# EAGLE design SAMD21E-breakout (EAGLE 9.4.1)
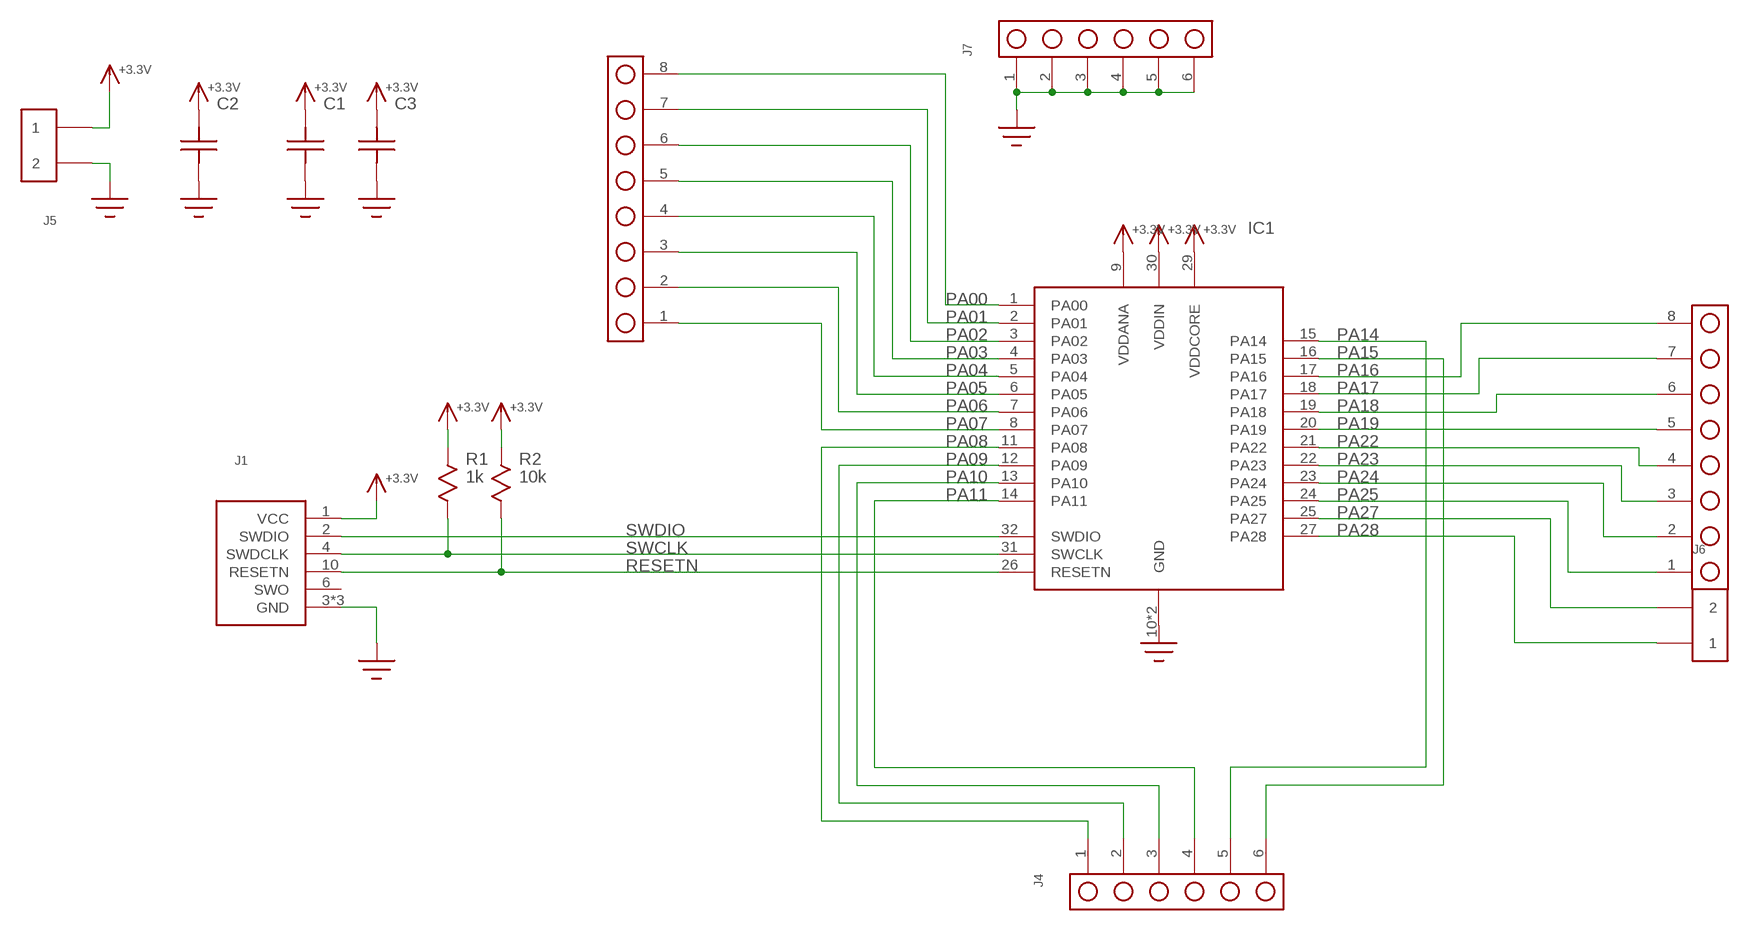
[diagram p0: schematic, sheet 1]

## Parts
C1  C0603  [C0603]
C2  C1206  [1206]
C3  C0603  [C0603]
IC1  SAMD21E  [TQFP32_7X7]
J1  SWD-ICSP-HEADER  [HEADER-2X5-50MIL]
J2  HEADER_8PIN  [HEADER_8_PIN]
J3  HEADER_8PIN  [HEADER_8_PIN]
J4  HEADER_6PIN  [HEADER_6PIN]
J5  HEADER_2PIN  [HEADER_2PIN]
J6  HEADER_2PIN  [HEADER_2PIN]
J7  HEADER_6PIN  [HEADER_6PIN]
R1  1k  R0603  [R0603]
R2  10k  R0603  [R0603]

## Nets
+3.3V: C1.P$2 C2.P$2 C3.P$2 IC1.9(VDDANA) IC1.29(VDDCORE) IC1.30(VDDIN) J1.1(VCC) J5.1 R1.P$1 R2.P$1
GND: C1.P$1 C2.P$1 C3.P$1 IC1.10(GND) IC1.28(GND) J1.3(GND) J1.5(GND) J1.9(GND) J5.2 J7.1 J7.2 J7.3 J7.4 J7.5 J7.6
PA00: IC1.1(PA00) J2.8
PA01: IC1.2(PA01) J2.7
PA02: IC1.3(PA02) J2.6
PA03: IC1.4(PA03) J2.5
PA04: IC1.5(PA04) J2.4
PA05: IC1.6(PA05) J2.3
PA06: IC1.7(PA06) J2.2
PA07: IC1.8(PA07) J2.1
PA08: IC1.11(PA08) J4.1
PA09: IC1.12(PA09) J4.2
PA10: IC1.13(PA10) J4.3
PA11: IC1.14(PA11) J4.4
PA14: IC1.15(PA14) J4.5
PA15: IC1.16(PA15) J4.6
PA16: IC1.17(PA16) J3.8
PA17: IC1.18(PA17) J3.7
PA18: IC1.19(PA18) J3.6
PA19: IC1.20(PA19) J3.5
PA22: IC1.21(PA22) J3.4
PA23: IC1.22(PA23) J3.3
PA24: IC1.23(PA24) J3.2
PA25: IC1.24(PA25) J3.1
PA27: IC1.25(PA27) J6.2
PA28: IC1.27(PA28) J6.1
RESETN: IC1.26(RESETN) J1.10(RESETN) R2.P$2
SWCLK: IC1.31(SWCLK) J1.4(SWDCLK) R1.P$2
SWDIO: IC1.32(SWDIO) J1.2(SWDIO)
Unconnected: J1.6(SWO)

## Library data of the parts
C1-C3 = yapo:C
IC1 = yapo:SAMD21E
J1 = yapo:SWD-ICSP-HEADER
J2 J3 = yapo:HEADER_8PIN
J4 J7 = yapo:HEADER_6PIN
J5 J6 = yapo:HEADER_2PIN
R1 R2 = yapo:R

## Board
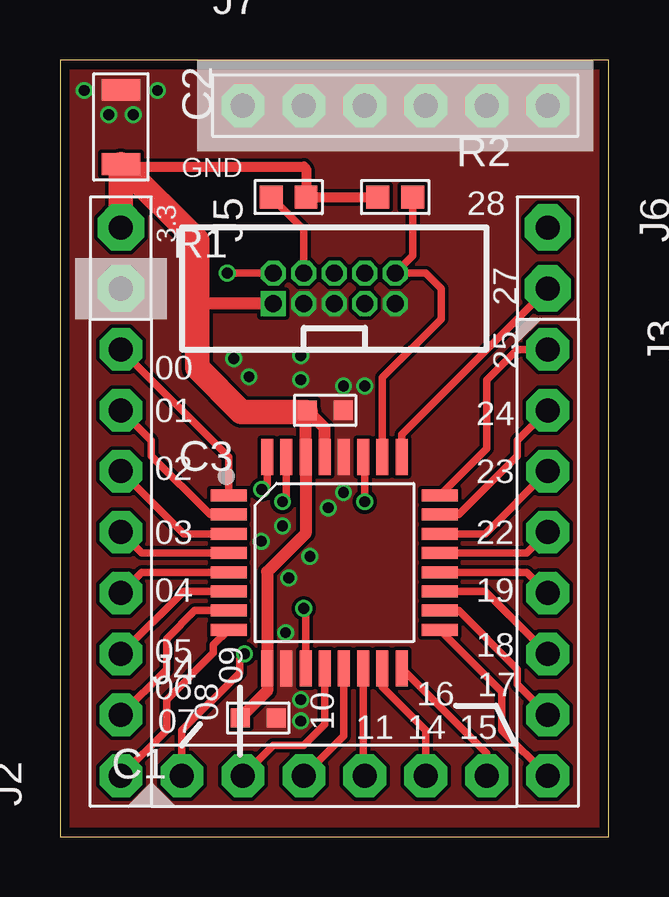
[diagram p1: board, top side]
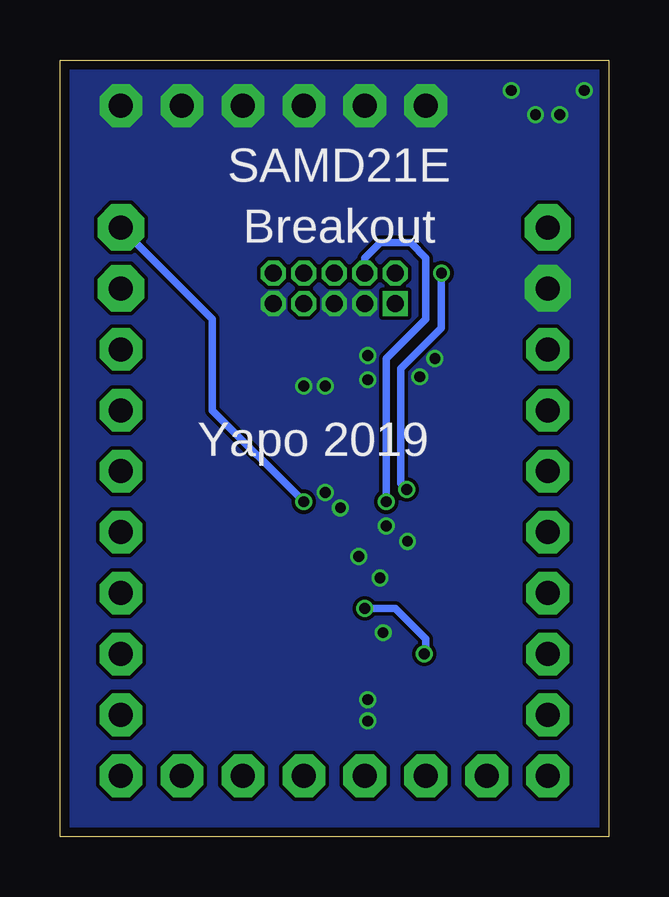
[diagram p2: board, bottom side, seen from below]

Size 22.86 x 32.38 mm. Coordinates in mm from the lower left corner, seen from the top.
Outline: 0,0 22.86,0 22.86,32.38 0,32.38 0,0
Copper layers (1*16): Top 0.035559375mm / dielectric 1.6mm / Bottom 0.035559375mm
Design rules "oshpark-2layer *": minimum track width 6mil, minimum drill 10mil, track to track 6mil, track to pad 6mil, pad to pad 6mil, via to via 6mil, smd to smd 6mil, copper to edge 15mil, drill to drill 6mil, minimum pad ring 5mil, minimum via ring 5mil, stop-mask expansion 2.5mil, vias tented up to drill 20mil, thermal gap 10mil

### Footprints (pad centres in the part's own frame; a part is rotated, then mirrored left to right if it is on the bottom)
C0603 = smd 0.8 x 0.8: P$1 -0.75,0; P$2 0.75,0
1206 = smd 0.9 x 1.6: P$1 -1.55,0; P$2 1.55,0
TQFP32_7X7 = smd 1.5 x 0.5: 1 -4.4,2.8; 2 -4.4,2; 3 -4.4,1.2; 4 -4.4,0.4; 5 -4.4,-0.4; 6 -4.4,-1.2; 7 -4.4,-2; 8 -4.4,-2.8; 17 4.4,-2.8; 18 4.4,-2; 19 4.4,-1.2; 20 4.4,-0.4; 21 4.4,0.4; 22 4.4,1.2; 23 4.4,2; 24 4.4,2.8 | smd 0.5 x 1.5: 9 -2.8,-4.4; 10 -2,-4.4; 11 -1.2,-4.4; 12 -0.4,-4.4; 13 0.4,-4.4; 14 1.2,-4.4; 15 2,-4.4; 16 2.8,-4.4; 25 2.8,4.4; 26 2,4.4; 27 1.2,4.4; 28 0.4,4.4; 29 -0.4,4.4; 30 -1.2,4.4; 31 -2,4.4; 32 -2.8,4.4
HEADER-2X5-50MIL = drill 0.7 pad 1.016 square: 1 -2.54,-0.635 | drill 0.7 pad 1.016 octagon: 2 -2.54,0.635; 3 -1.27,-0.635; 4 -1.27,0.635; 5 0,-0.635; 6 0,0.635; 7 1.27,-0.635; 8 1.27,0.635; 9 2.54,-0.635; 10 2.54,0.635
HEADER_8_PIN = drill 1 pad 1.778 octagon: 1 -8.89,0; 2 -6.35,0; 3 -3.81,0; 4 -1.27,0; 5 1.27,0; 6 3.81,0; 7 6.35,0; 8 8.89,0
HEADER_6PIN = drill 1 pad 1.778 octagon: 1 -6.35,0; 2 -3.81,0; 3 -1.27,0; 4 1.27,0; 5 3.81,0; 6 6.35,0
HEADER_2PIN = drill 1 pad 1.93 octagon: 1 -1.27,0; 2 1.27,0
R0603 = smd 0.95 x 0.95: P$1 -0.725,0; P$2 0.725,0

### Placement (x,y rotation side)
C1  8.26,4.95 180 top
C2  2.54,29.59 270 top
C3  11.05,17.78 180 top
IC1  11.43,11.43 0 top
J1  11.43,22.86 0 top
J2  2.54,11.43 90 top
J3  20.32,11.43 270 top
J4  11.43,2.54 0 top
J5  2.54,24.13 270 top
J6  20.32,24.13 270 top
J7  13.97,30.48 0 top
R1  9.53,26.67 180 top
R2  13.97,26.67 0 top

### Tracks (layer width: path | path; a pad name or v marks a point on that pad's centre or on a via)
+3.3V
  Top 0.406: C2.P$2 2.64,27.94 10.16,27.94 10.25,27.85 R1.P$1 R2.P$1
  Top 0.508: C1.P$2 8.63,6.08 IC1.9 8.63,11.04 10.23,12.64 IC1.30 10.23,17.71 C3.P$2 11.03,17.05 IC1.29 | J1.1 5.71,22.23
  Top 1.016: J5.1 C2.P$2 5.71,24.87 5.71,22.23 5.71,19.56 7.56,17.71 10.23,17.71
GND  (via drill 0.45)
  other vias: 9.4,8.51 11.81,14.35 11.81,18.8 12.7,18.8 9.53,10.79 10.41,11.68 9.27,12.95 8.38,12.32 10.03,20.07 10.03,19.05 7.87,19.18 7.24,19.94 1.02,31.11 4.06,31.11 3.05,30.1 2.03,30.1 10.03,4.83 10.03,5.71 11.18,13.72
  pour Top (no thermals): 0,0 0,32.38 22.86,32.38 22.86,0
  pour Bottom (no thermals): 0,0 0,32.38 22.86,32.38 22.86,0
PA00
  Top 0.305: IC1.1 7.03,15.83 J2.8
PA01
  Top 0.305: IC1.2 6.25,13.43 3.81,15.88 3.81,16.51 J2.7
PA02
  Top 0.305: IC1.3 5.15,12.63 J2.6
PA03
  Top 0.305: IC1.4 3.41,11.83 J2.5
PA04
  Top 0.305: IC1.5 3.41,11.03 J2.4
PA05
  Top 0.305: IC1.6 5.15,10.23 J2.3
PA06
  Top 0.305: IC1.7 5.62,9.43 4.45,8.26 4.45,6.99 J2.2
PA07
  Top 0.305: IC1.8 6.39,8 6.39,7.67 4.45,5.71 4.45,4.45 J2.1
PA08  (via drill 0.45)
  Top 0.305: IC1.11 10.23,9.46 v10.16,9.53 | v7.69,7.62 7.49,7.42 7.49,6.84 5.08,4.43 J4.1
  Bottom 0.305: v10.16,9.53 8.89,9.53 7.62,8.26 7.62,7.69 v7.69,7.62
PA09
  Top 0.305: IC1.12 11.03,4.68 10.16,3.81 8.89,3.81 J4.2
PA10
  Top 0.305: IC1.13 11.83,4.21 J4.3
PA11
  Top 0.305: IC1.14 12.63,2.61 J4.4
PA14
  Top 0.305: IC1.15 13.43,6.25 15.24,4.45 J4.5
PA15
  Top 0.305: IC1.16 17.78,3.48 J4.6
PA16
  Top 0.305: IC1.17 18.41,6.04 18.41,4.45 J3.8
PA17
  Top 0.305: IC1.18 16.61,9.43 19.05,6.99 19.05,6.35 J3.7
PA18
  Top 0.305: IC1.19 17.71,10.23 J3.6
PA19
  Top 0.305: IC1.20 19.45,11.03 J3.5
PA22
  Top 0.305: IC1.21 19.45,11.83 J3.4
PA23
  Top 0.305: IC1.22 17.71,12.63 J3.3
PA24
  Top 0.305: IC1.23 16.61,13.43 19.05,15.88 19.05,16.51 J3.2
PA25
  Top 0.305: IC1.24 17.78,16.18 17.78,19.05 19.05,20.32 J3.1
PA27
  Top 0.305: IC1.25 14.23,16.77 J6.2
PA28  (via drill 0.45)
  Top 0.305: IC1.27 12.7,15.76 v12.7,13.97
  Bottom 0.305: v12.7,13.97 16.51,17.78 16.51,21.59 J6.1
RESETN
  Top 0.305: R2.P$2 14.7,24.22 J1.10 15.24,23.5 15.88,22.86 15.88,21.59 13.43,19.14 IC1.26
SWCLK  (via drill 0.45)
  Top 0.305: IC1.31 9.43,14.13 v9.27,13.97 | R1.P$2 10.16,25.31 J1.4
  Bottom 0.305: v9.27,13.97 9.27,19.94 7.62,21.59 7.62,24.13 8.26,24.77 9.53,24.77 10.16,24.13 J1.4
SWDIO  (via drill 0.45)
  Top 0.305: IC1.32 8.63,14.7 v8.41,14.48 | v6.96,23.5 J1.2
  Bottom 0.305: v8.41,14.48 8.66,14.73 8.66,19.53 6.99,21.21 6.99,23.5 v6.96,23.5

### Text on the board
tPlace: GND | 28 | 3.3 | 27 | 25 | 00 | 24 | 01 | 23 | 02 | 22 | 03 | 19 | 04 | 18 | 05 | 06 | 09 | 17 | 08 | 16 | 07 | 10 | 11 | 14 | 15
bPlace: SAMD21E | Breakout | Yapo 2019